# Altium schematic sheet Peredat4ik.SchDoc
size A4
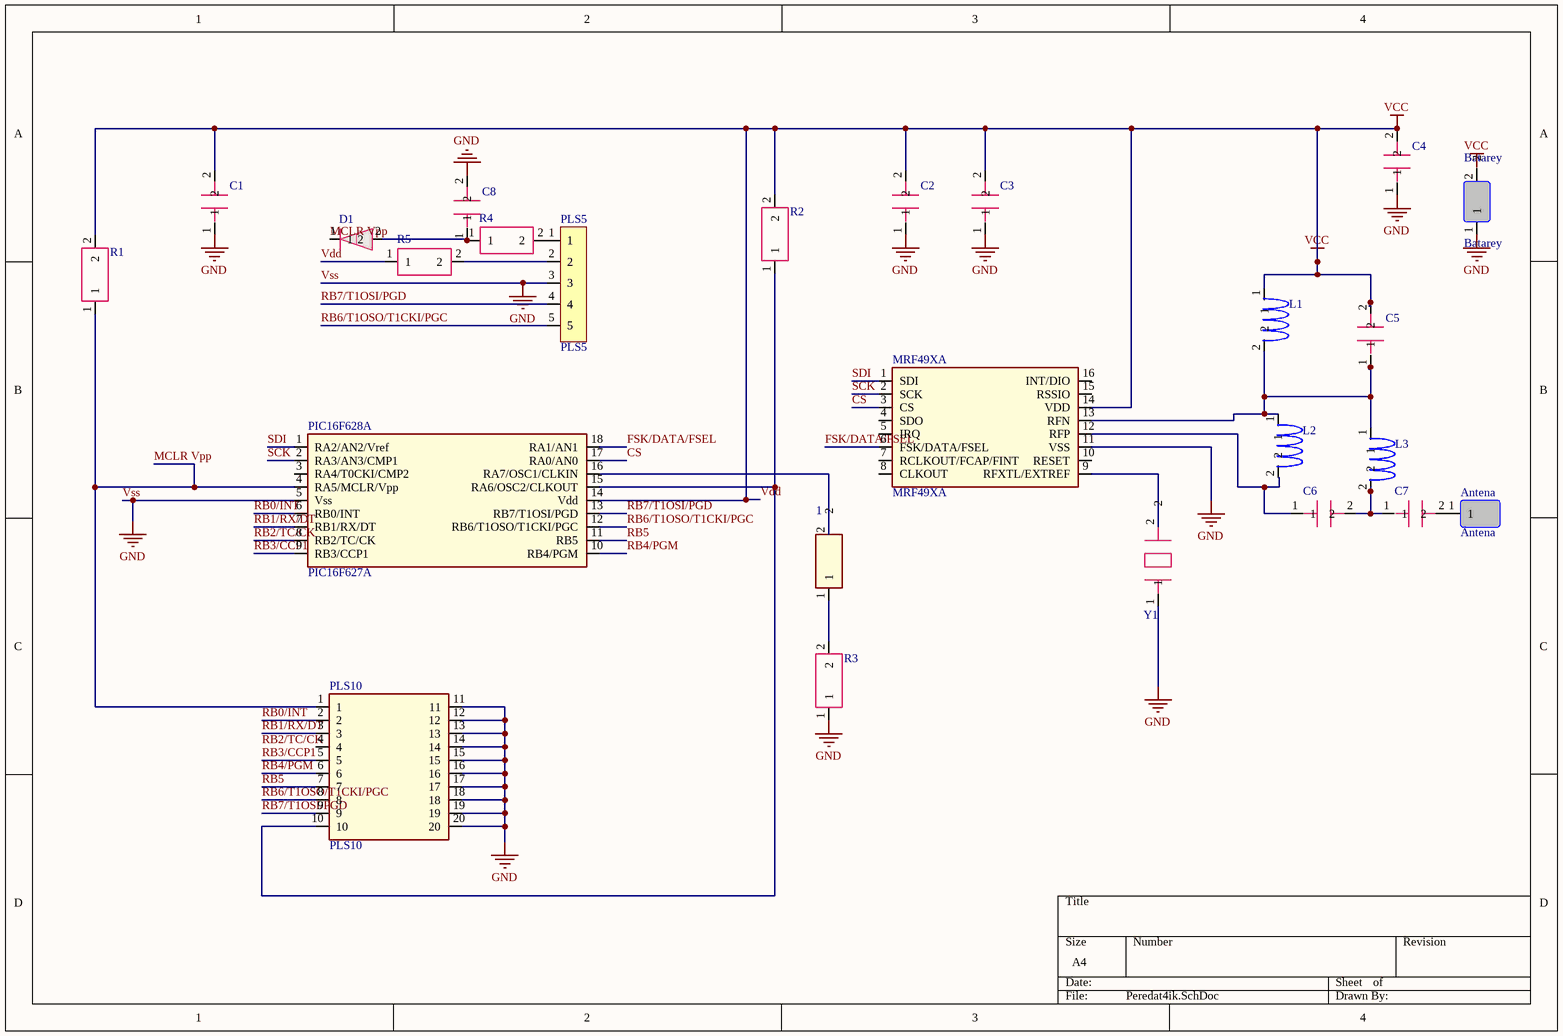
[diagram p0: Peredat4ik.SchDoc]

## Parts
1  (no value)  [Light-emitting diode]
?  Y1  [Quartz]
Antena  Antena  [Anteny]
Batarey  Batarey  [Batarey]
C1  (no value)  [С0805]
C2  (no value)  [С0805]
C3  (no value)  [С0805]
C4  (no value)  [С0805]
C5  (no value)  [С0805]
C6  (no value)  [С0805]
C7  (no value)  [С0805]
C8  (no value)  [С0805]
D1  (no value)  [diode]
L1  (no value)  [L?]
L2  (no value)  [L?]
L3  (no value)  [L?]
MRF49XA  MRF49XA  [MRF49XA]
PIC16F628A  PIC16F627A  [PIC16F627A]
PLS5  PLS5  [PLS5]
PLS10  PLS10  [PLS10]
R1  (no value)  [R0805]
R2  (no value)  [R0805]
R3  (no value)  [R0805]
R4  (no value)  [R0805]
R5  (no value)  [R0805]

## Nets
Vdd: C1.2 C2.2 C3.2 C4.2 C5.2 L1.1 MRF49XA.14(VDD) PIC16F628A.14(Vdd) R1.2 R2.2 R5.1  [also labelled VCC]
Vss: ?.1 Batarey.1 C1.1 C2.1 C3.1 C4.1 C8.2 MRF49XA.11(VSS) PIC16F628A.5(Vss) PLS5.3 PLS10.11 PLS10.12 PLS10.13 PLS10.14 PLS10.15 PLS10.16 PLS10.17 PLS10.18 PLS10.19 PLS10.20 R3.1  [also labelled GND]
CS: MRF49XA.3(CS) PIC16F628A.17(RA0/AN0)
FSK/DATA/FSEL: MRF49XA.6(FSK/DATA/FSEL) PIC16F628A.18(RA1/AN1)
MCLR Vpp: D1.1 PIC16F628A.4(RA5/MCLR/Vpp) PLS10.1 R1.1
RB0/INT: PIC16F628A.6(RB0/INT) PLS10.2
RB1/RX/DT: PIC16F628A.7(RB1/RX/DT) PLS10.3
RB2/TC/CK: PIC16F628A.8(RB2/TC/CK)
RB3/CCP1: PIC16F628A.9(RB3/CCP1) PLS10.5
RB4/PGM: PIC16F628A.10(RB4/PGM) PLS10.6
RB5: PIC16F628A.11(RB5) PLS10.7
RB6/T1OSO/T1CKI/PGC: PIC16F628A.12(RB6/T1OSO/T1CKI/PGC) PLS5.5 PLS10.8
RB7/T1OSI/PGD: PIC16F628A.13(RB7/T1OSI/PGD) PLS5.4 PLS10.9
SCK: MRF49XA.2(SCK) PIC16F628A.2(RA3/AN3/CMP1)
SDI: MRF49XA.1(SDI) PIC16F628A.1(RA2/AN2/Vref)
Net1_1: 1.1 R3.2
Net1_2: 1.2 PIC16F628A.16(RA7/OSC1/CLKIN)
Net?_2: ?.2 MRF49XA.9(RFXTL/EXTREF)
NetAntena_1: Antena.1 C7.2
NetC5_1: C5.1 L1.2 L2.1 L3.1 MRF49XA.13(RFN)
NetC6_1: C6.1 L2.2 MRF49XA.12(RFP)
NetC6_2: C6.2 C7.1 L3.2
NetC8_1: C8.1 D1.2 R4.1
NetPIC16F628A_15: PIC16F628A.15(RA6/OSC2/CLKOUT) PLS10.10 R2.1
NetPLS5_1: PLS5.1 R4.2
NetPLS5_2: PLS5.2 R5.2

Not connected (* = marked no-connect by the designer): Batarey 2; MRF49XA 4(SDO) 5(IRQ) 7(RCLKOUT/FCAP/FINT) 8(CLKOUT) 10(RESET) 15(RSSIO) 16(INT/DIO); PIC16F628A 3(RA4/T0CKI/CMP2); PLS10 4

## Notes on the sheet
- Labels drawn without touching a wire or pin: RB2/TC/CK, VCC

## Library data of the parts
1 = Light-emitting diode
? = Quartz
C1-C8 = Capacity
D1 = diode
L1-L3 = Inductance
R1-R5 = Rezistor